# Altium project IO_Project.PrjPcb
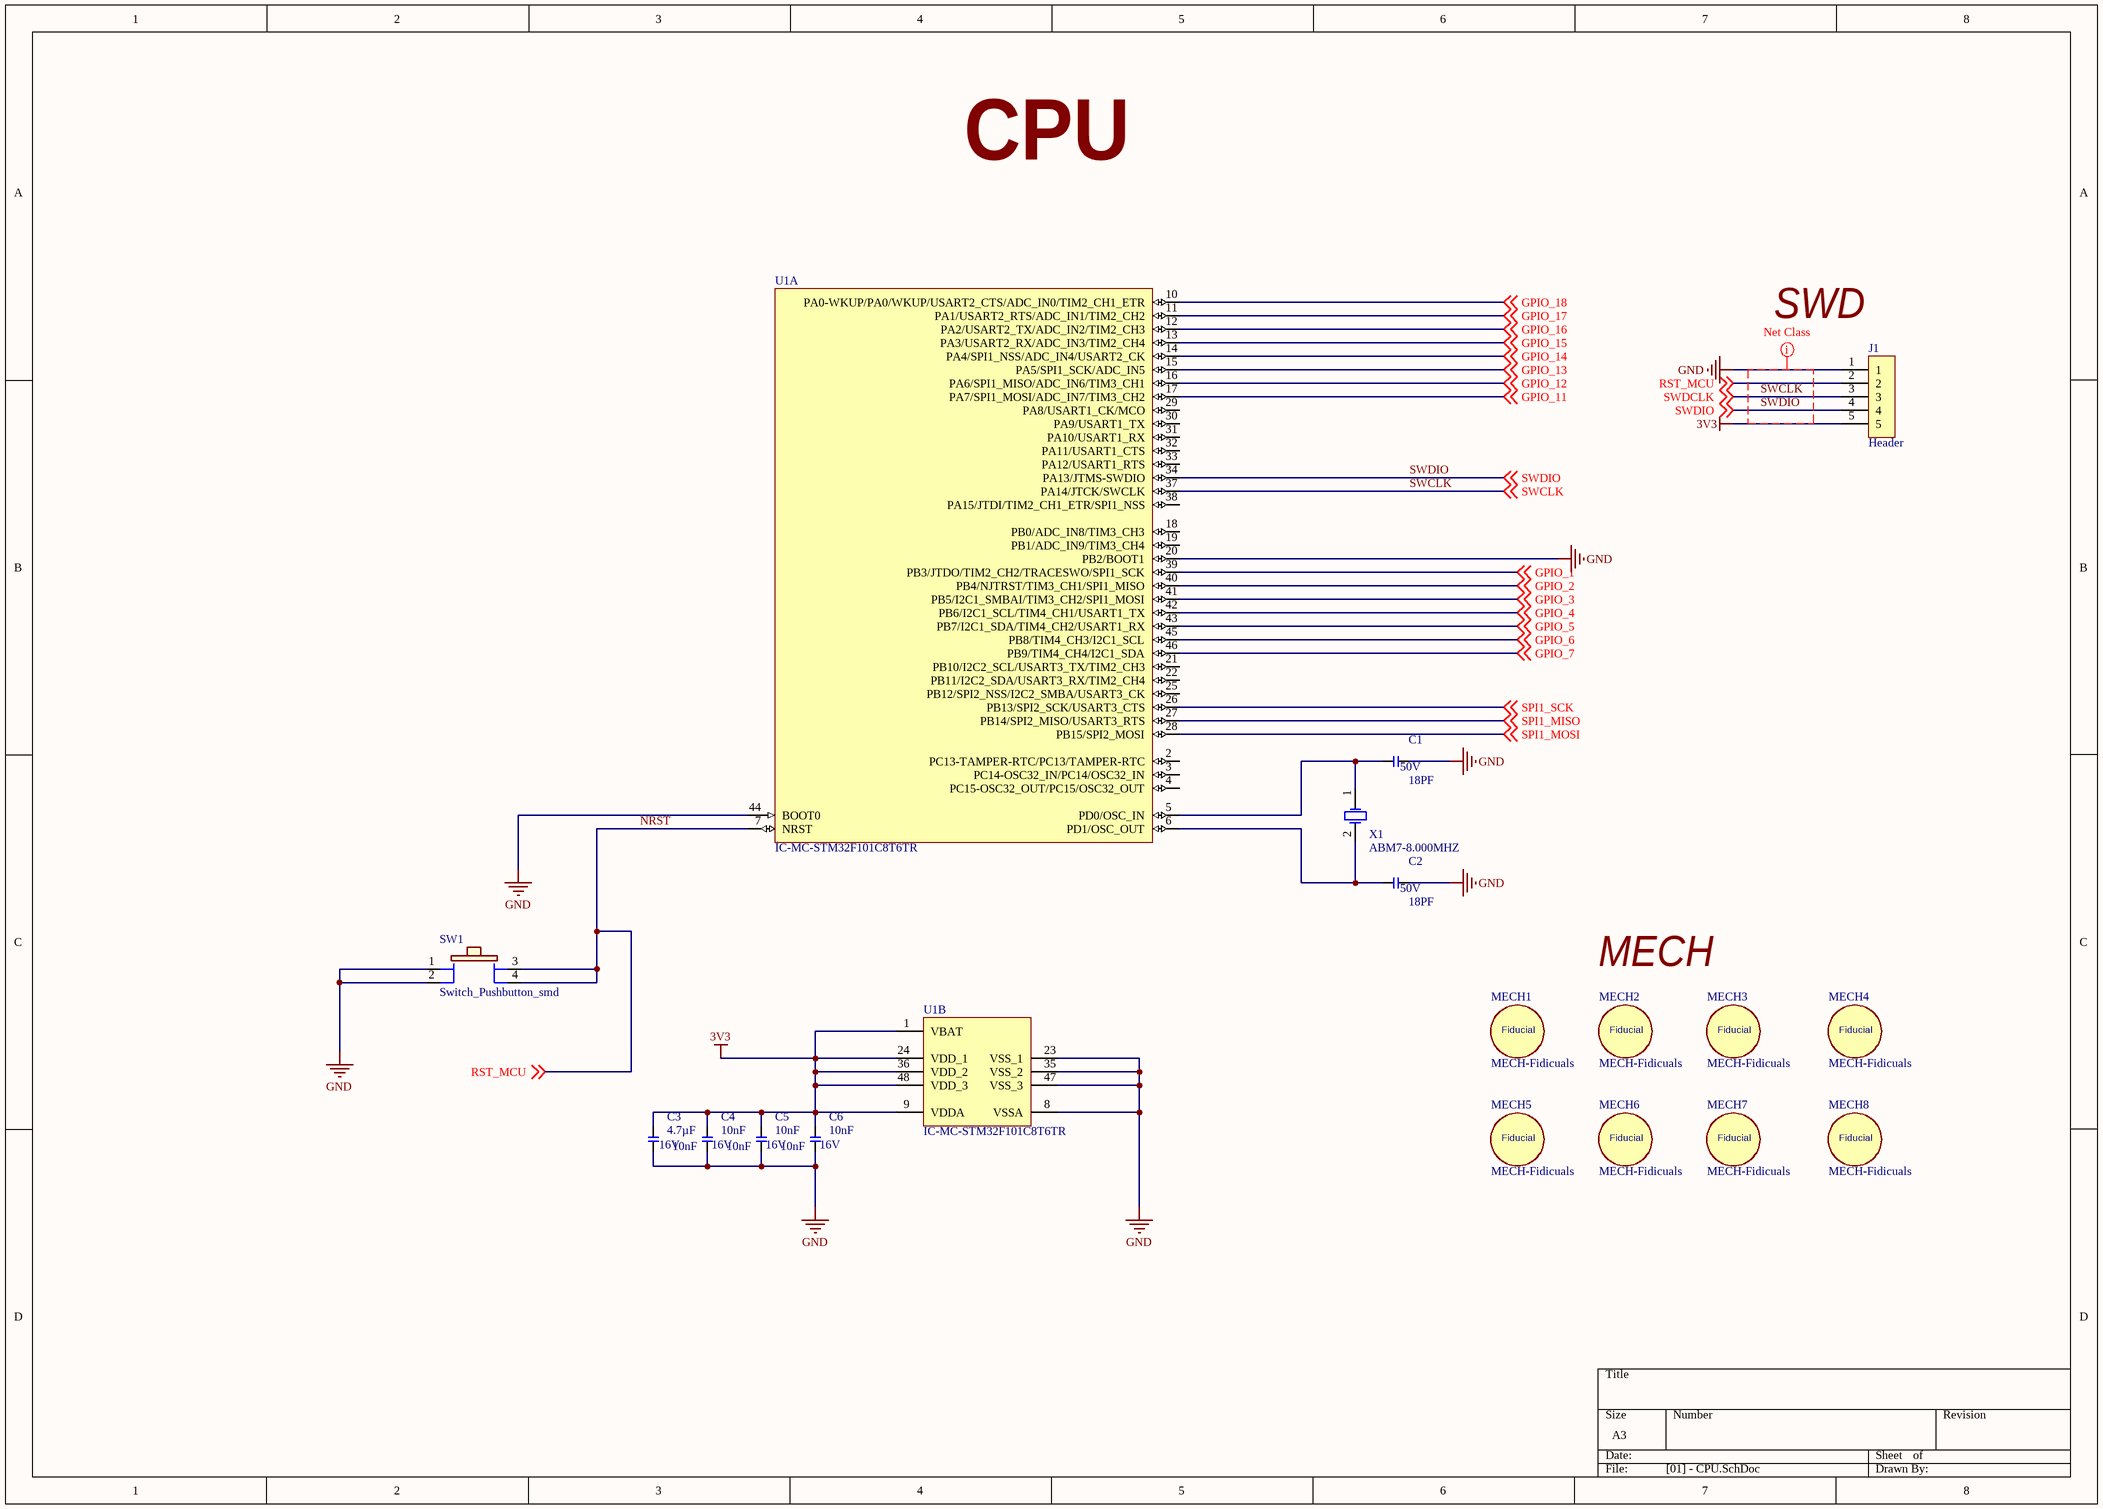
[diagram p0: [01] - CPU.SchDoc]
3 sheets, 47 parts. Net scope: global (net labels, ports and power ports of the same name join across sheets).
Board file: IO_PCB.PcbDoc
Sheets:
  [01] - CPU.SchDoc
  [02] - IO.SchDoc
  [03] - miniPCI.SchDoc

## Sheet [01] - CPU.SchDoc
size A3

### Parts
C1  18PF  voltage_rating_dc: 50V  [C0805]
C2  18PF  voltage_rating_dc: 50V  [C0805]
C3  4.7µF  Voltage - Rated: 16V  [C0805]
C4  10nF  Voltage - Rated: 16V  [C0805]
C5  10nF  Voltage - Rated: 16V  [C0805]
C6  10nF  Voltage - Rated: 16V  [C0805]
J1  Header  [Header 1x5 2.54mm]
MECH1  MECH-Fidicuals  [T-Fidicuals]
MECH2  MECH-Fidicuals  [T-Fidicuals]
MECH3  MECH-Fidicuals  [T-Fidicuals]
MECH4  MECH-Fidicuals  [T-Fidicuals]
MECH5  MECH-Fidicuals  [T-Fidicuals]
MECH6  MECH-Fidicuals  [T-Fidicuals]
MECH7  MECH-Fidicuals  [T-Fidicuals]
MECH8  MECH-Fidicuals  [T-Fidicuals]
SW1  Switch_Pushbutton_smd  [SW_B3SL-1022P]
U1  IC-MC-STM32F101C8T6TR  [STM-LQFP48_M]  (parts A,B of 2)
X1  ABM7-8.000MHZ  [sm_osc_mixed]

### Nets
3V3: C3.2 C4.2 C5.2 C6.2 J1.5 U1.1(VBAT) U1.9(VDDA) U1.24(VDD_1) U1.36(VDD_2) U1.48(VDD_3)
GND: C1.2 C2.2 C3.1 C4.1 C5.1 C6.1 J1.1 SW1.1 SW1.2 U1.8(VSSA) U1.20(PB2/BOOT1) U1.23(VSS_1) U1.35(VSS_2) U1.44(BOOT0) U1.47(VSS_3)
GPIO_1: U1.39(PB3/JTDO/TIM2_CH2/TRACESWO/SPI1_SCK) ; off-sheet GPIO_1  [project net gp_1]
GPIO_2: U1.40(PB4/NJTRST/TIM3_CH1/SPI1_MISO) ; off-sheet GPIO_2  [project net gp_2]
GPIO_3: U1.41(PB5/I2C1_SMBAI/TIM3_CH2/SPI1_MOSI) ; off-sheet GPIO_3  [project net gp_3]
GPIO_4: U1.42(PB6/I2C1_SCL/TIM4_CH1/USART1_TX) ; off-sheet GPIO_4  [project net gp_4]
GPIO_5: U1.43(PB7/I2C1_SDA/TIM4_CH2/USART1_RX) ; off-sheet GPIO_5  [project net gp_5]
GPIO_6: U1.45(PB8/TIM4_CH3/I2C1_SCL) ; off-sheet GPIO_6  [project net gp_6]
GPIO_7: U1.46(PB9/TIM4_CH4/I2C1_SDA) ; off-sheet GPIO_7  [project net gp_7]
GPIO_11: U1.17(PA7/SPI1_MOSI/ADC_IN7/TIM3_CH2) ; off-sheet GPIO_11  [project net gpo_1]
GPIO_12: U1.16(PA6/SPI1_MISO/ADC_IN6/TIM3_CH1) ; off-sheet GPIO_12  [project net gpo_2]
GPIO_13: U1.15(PA5/SPI1_SCK/ADC_IN5) ; off-sheet GPIO_13  [project net gpo_3]
GPIO_14: U1.14(PA4/SPI1_NSS/ADC_IN4/USART2_CK) ; off-sheet GPIO_14  [project net gpo_4]
GPIO_15: U1.13(PA3/USART2_RX/ADC_IN3/TIM2_CH4) ; off-sheet GPIO_15  [project net gpo_5]
GPIO_16: U1.12(PA2/USART2_TX/ADC_IN2/TIM2_CH3) ; off-sheet GPIO_16  [project net gpo_6]
GPIO_17: U1.11(PA1/USART2_RTS/ADC_IN1/TIM2_CH2) ; off-sheet GPIO_17  [project net gpo_7]
GPIO_18: U1.10(PA0-WKUP/PA0/WKUP/USART2_CTS/ADC_IN0/TIM2_CH1_ETR) ; off-sheet GPIO_18  [project net gpo_8]
NRST: J1.2 SW1.3 SW1.4 U1.7(NRST) ; off-sheet RST_MCU  [also labelled RST_MCU]
SPI1_MISO: U1.27(PB14/SPI2_MISO/USART3_RTS) ; off-sheet SPI1_MISO
SPI1_MOSI: U1.28(PB15/SPI2_MOSI) ; off-sheet SPI1_MOSI
SPI1_SCK: U1.26(PB13/SPI2_SCK/USART3_CTS) ; off-sheet SPI1_SCK
SWCLK: J1.3 U1.37(PA14/JTCK/SWCLK) ; off-sheet SWCLK, off-sheet SWDCLK  [also labelled SWDCLK]
SWDIO: J1.4 U1.34(PA13/JTMS-SWDIO) ; off-sheet SWDIO
NetC1_1: C1.1 U1.5(PD0/OSC_IN) X1.1(OSC1)
NetC2_1: C2.1 U1.6(PD1/OSC_OUT) X1.2(OSC2)

Not connected (* = marked no-connect by the designer): U1 2(PC13-TAMPER-RTC/PC13/TAMPER-RTC) 3(PC14-OSC32_IN/PC14/OSC32_IN) 4(PC15-OSC32_OUT/PC15/OSC32_OUT) 18(PB0/ADC_IN8/TIM3_CH3) 19(PB1/ADC_IN9/TIM3_CH4) 21(PB10/I2C2_SCL/USART3_TX/TIM2_CH3) 22(PB11/I2C2_SDA/USART3_RX/TIM2_CH4) 25(PB12/SPI2_NSS/I2C2_SMBA/USART3_CK) 29(PA8/USART1_CK/MCO) 30(PA9/USART1_TX) 31(PA10/USART1_RX) 32(PA11/USART1_CTS) 33(PA12/USART1_RTS) 38(PA15/JTDI/TIM2_CH1_ETR/SPI1_NSS)

### Layout directives
net class SWD: GND

### Notes on the sheet
- CPU
- (near J1) SWD
- MECH
- (in symbol MECH-Fidicuals) Fiducial

### Library data of the parts
C1 C2 = C-18PF,50V,0805: MULTICOMP - MC0805N180J500CT - CAP, MLCC, C0G/NP0, 18PF, 50V,0805, REEL; capacitance_tolerance: ±5%; pin_count: 2; Supplier 1: Octopart; Manufacturer: Multicomp; Manufacturer Part Number: MC0805N180J500CT; Pricing 1: 1=0.11400, 10=0.07300, 50=0.04100, 100=0.03200, 250=0.02600, 500=0.02200, 1000=0.01800 (USD); capacitance: 18PF; ComponentLink1URL: http://datasheet.octopart.com/MC0805N180J500CT-Multicomp-datasheet-16478625.pdf; ComponentLink1Description: http://datasheet.octopart.com/MC0805N180J500CT-Multicomp-datasheet-16478625.pdf; Supplier Part Number 1: Newark - 06R4039; Stock 1: 3187; reach_svhc_compliance: No SVHC; rohs_status: Compliant; dielectric_characteristic: C0G/NP0; Octopart Url: http://octopart.com/mc0805n180j500ct-multicomp-10529169; Seller Landing  Url: https://octopart-clicks.com/click/track?country=TR&ak=8157f166&sig=03c9fd1&sid=2402&ppid=10529169&vpid=17760821&ct=offers; OctopartID: 811748bd0de05ed0; ComponentLink2URL: http://datasheet.octopart.com/MC0805N180J500CT-Multicomp-datasheet-22150886.pdf; ComponentLink2Description: http://datasheet.octopart.com/MC0805N180J500CT-Multicomp-datasheet-22150886.pdf; ComponentLink3URL: http://datasheet.octopart.com/MC0805N180J500CT-Multicomp-datasheet-8445804.pdf; ComponentLink3Description: http://datasheet.octopart.com/MC0805N180J500CT-Multicomp-datasheet-8445804.pdf; ComponentLink4URL: http://datasheet.octopart.com/MC0805N180J500CT-Multicomp-datasheet-34215986.pdf; ComponentLink4Description: http://datasheet.octopart.com/MC0805N180J500CT-Multicomp-datasheet-34215986.pdf; ComponentLink5URL: http://datasheet.octopart.com/MC0805N180J500CT-Multicomp-datasheet-26590290.pdf; ComponentLink5Description: http://datasheet.octopart.com/MC0805N180J500CT-Multicomp-datasheet-26590290.pdf; ComponentLink6URL: http://datasheet.octopart.com/MC0805N180J500CT-Multicomp-datasheet-15500401.pdf; ComponentLink6Description: http://datasheet.octopart.com/MC0805N180J500CT-Multicomp-datasheet-15500401.pdf; ComponentLink7URL: http://datasheet.octopart.com/MC0805N180J500CT-Multicomp-datasheet-10838970.pdf; ComponentLink7Description: http://datasheet.octopart.com/MC0805N180J500CT-Multicomp-datasheet-10838970.pdf
C3 = C-4.7UF,16V,0805: AVX - 0805YC475KAT2A - CAP, MLCC, X7R, 4.7UF, 16V, 0805; Manufacturer: AVX Corporation; Tolerance: ±10%; Supplier 1: Digi-Key; Manufacturer Part Number: 0805YC475KAT2A; RoHS: RoHS Compliant; Stock 1: 16611; Pricing 1: 1=0.78, 10=0.578, 25=0.4952, 50=0.462, 100=0.396, 250=0.363, 500=0.3135, 1000=0.264 (USD); Capacitance: 4.7µF; Packaging: Cut Tape (CT); ComponentLink1URL: http://datasheets.avx.com/X7RDielectric.pdf; ComponentLink1Description: http://datasheets.avx.com/X7RDielectric.pdf; Supplier Part Number 1: 478-5722-1-ND; Category: Capacitors; Temperature Coefficient: X7R; Mounting Type: Surface Mount, MLCC; Operating Temperature: -55°C ~ 125°C; Applications: General Purpose; Ratings: -; Package / Case: 0805 (2012 Metric); Size / Dimension: 0.079" L x 0.049" W (2.01mm x 1.25mm); Height - Seated (Max): -; Thickness (Max): 0.060" (1.52mm); Lead Spacing: -; Features: -; Lead Style: -
C4-C6 = C-10NF,16V,0805: CAP CER 10000PF 16V NP0 0805; Manufacturer: AVX Corporation; Manufacturer Part Number: 0805YA103JAT2A; Tolerance: ±5%; Temperature Coefficient: C0G, NP0; Supplier 1: Digi-Key; RoHS: RoHS Compliant; Stock 1: 28062; Pricing 1: 1=0.29, 10=0.204, 25=0.1668, 50=0.1424, 100=0.1221, 250=0.10176, 500=0.09158, 1000=0.07733 (USD); ComponentLink1URL: http://datasheets.avx.com/C0GNP0-Dielectric.pdf; ComponentLink1Description: http://datasheets.avx.com/C0GNP0-Dielectric.pdf; Supplier Part Number 1: 478-1334-1-ND; Category: Capacitors; Packaging: Cut Tape (CT); Mounting Type: Surface Mount, MLCC; Operating Temperature: -55°C ~ 125°C; Applications: General Purpose; Ratings: -; Package / Case: 0805 (2012 Metric); Size / Dimension: 0.079" L x 0.049" W (2.01mm x 1.25mm); Height - Seated (Max): -; Thickness (Max): 0.037" (0.94mm); Lead Spacing: -; Features: -; Lead Style: -; Capacitance: 10nF
J1 = CON-Header 1X5 2.54MM: Header 1X5 2.54
MECH1-MECH8 = MECH-Fidicuals: Fidicuals
SW1 = Switch_Pushbutton_smd: Switch Push Button tactile; TIIntPartnumber: 2W0018; MfrNum: B3SL-1022P; Mfr: Omron; PartName: SwitchPushMomTactilesmd; Cost10K: 0.25; Cost100: 0.340; Vendor: Digikey; DescriptiveText: Switch Push Button tactile; Descriptive_Text: Switch Push Button tactile
U1 = IC-MC-STM32F101C8T6TR: IC MCU 32BIT 64KB FLASH 48LQFP; Manufacturer: STMicroelectronics; Program Memory Size: 64KB (64K x 8); Core Processor: ARM® Cortex®-M3; Core Size: 32-Bit; Speed: 36MHz; Connectivity: I²C, IrDA, LIN, SPI, UART/USART; Peripherals: DMA, PDR, POR, PVD, PWM, Temp Sensor, WDT; Number of I/O: 37; RAM Size: 10K x 8; Voltage - Supply (Vcc/Vdd): 2 V ~ 3.6 V; Data Converters: A/D 10x12b; Oscillator Type: Internal; Supplier 1: Digi-Key; Manufacturer Part Number: STM32F101C8T6TR; RoHS: RoHS Compliant; Category: Integrated Circuits (ICs); Stock 1: 0; Pricing 1: 2400=2.46449 (USD); Packaging: Tape & Reel (TR); Program Memory Type: FLASH; ComponentLink1URL: http://www.st.com/content/ccc/resource/technical/document/datasheet/6b/28/4e/ce/a7/d3/42/8d/CD00161561.pdf/files/CD00161561.pdf/jcr:content/translations/en.CD00161561.pdf; ComponentLink1Description: http://www.st.com/content/ccc/resource/technical/document/datasheet/6b/28/4e/ce/a7/d3/42/8d/CD00161561.pdf/files/CD00161561.pdf/jcr:content/translations/en.CD00161561.pdf; Supplier Part Number 1: STM32F101C8T6TR-ND; EEPROM Size: -; Operating Temperature: -40°C ~ 85°C (TA); Package / Case: 48-LQFP; Supplier Device Package: 48-LQFP (7x7)
X1 = OSC-ABM7-8.000MHZ-D2Y-T: CRYSTAL 8.0000MHZ 18PF SMD; Manufacturer: Abracon LLC; Frequency: 8MHz; Frequency Stability: ±30ppm; Frequency Tolerance: ±20ppm; ESR (Equivalent Series Resistance): 100 Ohm; Operating Mode: Fundamental; Supplier 1: Digi-Key; Manufacturer Part Number: ABM7-8.000MHZ-D2Y-T; RoHS: RoHS Compliant; Category: Crystals and Oscillators; Stock 1: 111842; Pricing 1: 1=0.76, 10=0.678, 50=0.6328, 100=0.56, 500=0.5292 (USD); Packaging: Cut Tape (CT); Type: MHz Crystal; Load Capacitance: 18pF; Operating Temperature: -40°C ~ 85°C; Ratings: -; Mounting Type: Surface Mount; Package / Case: 2-SMD, No Lead (DFN, LCC); Size / Dimension: 0.236" L x 0.138" W (6.00mm x 3.50mm); Height: 0.055" (1.40mm); ComponentLink1URL: http://www.abracon.com/Resonators/abm7.pdf; ComponentLink1Description: http://www.abracon.com/Resonators/abm7.pdf; Supplier Part Number 1: 535-9831-1-ND

## Sheet [02] - IO.SchDoc
size A2
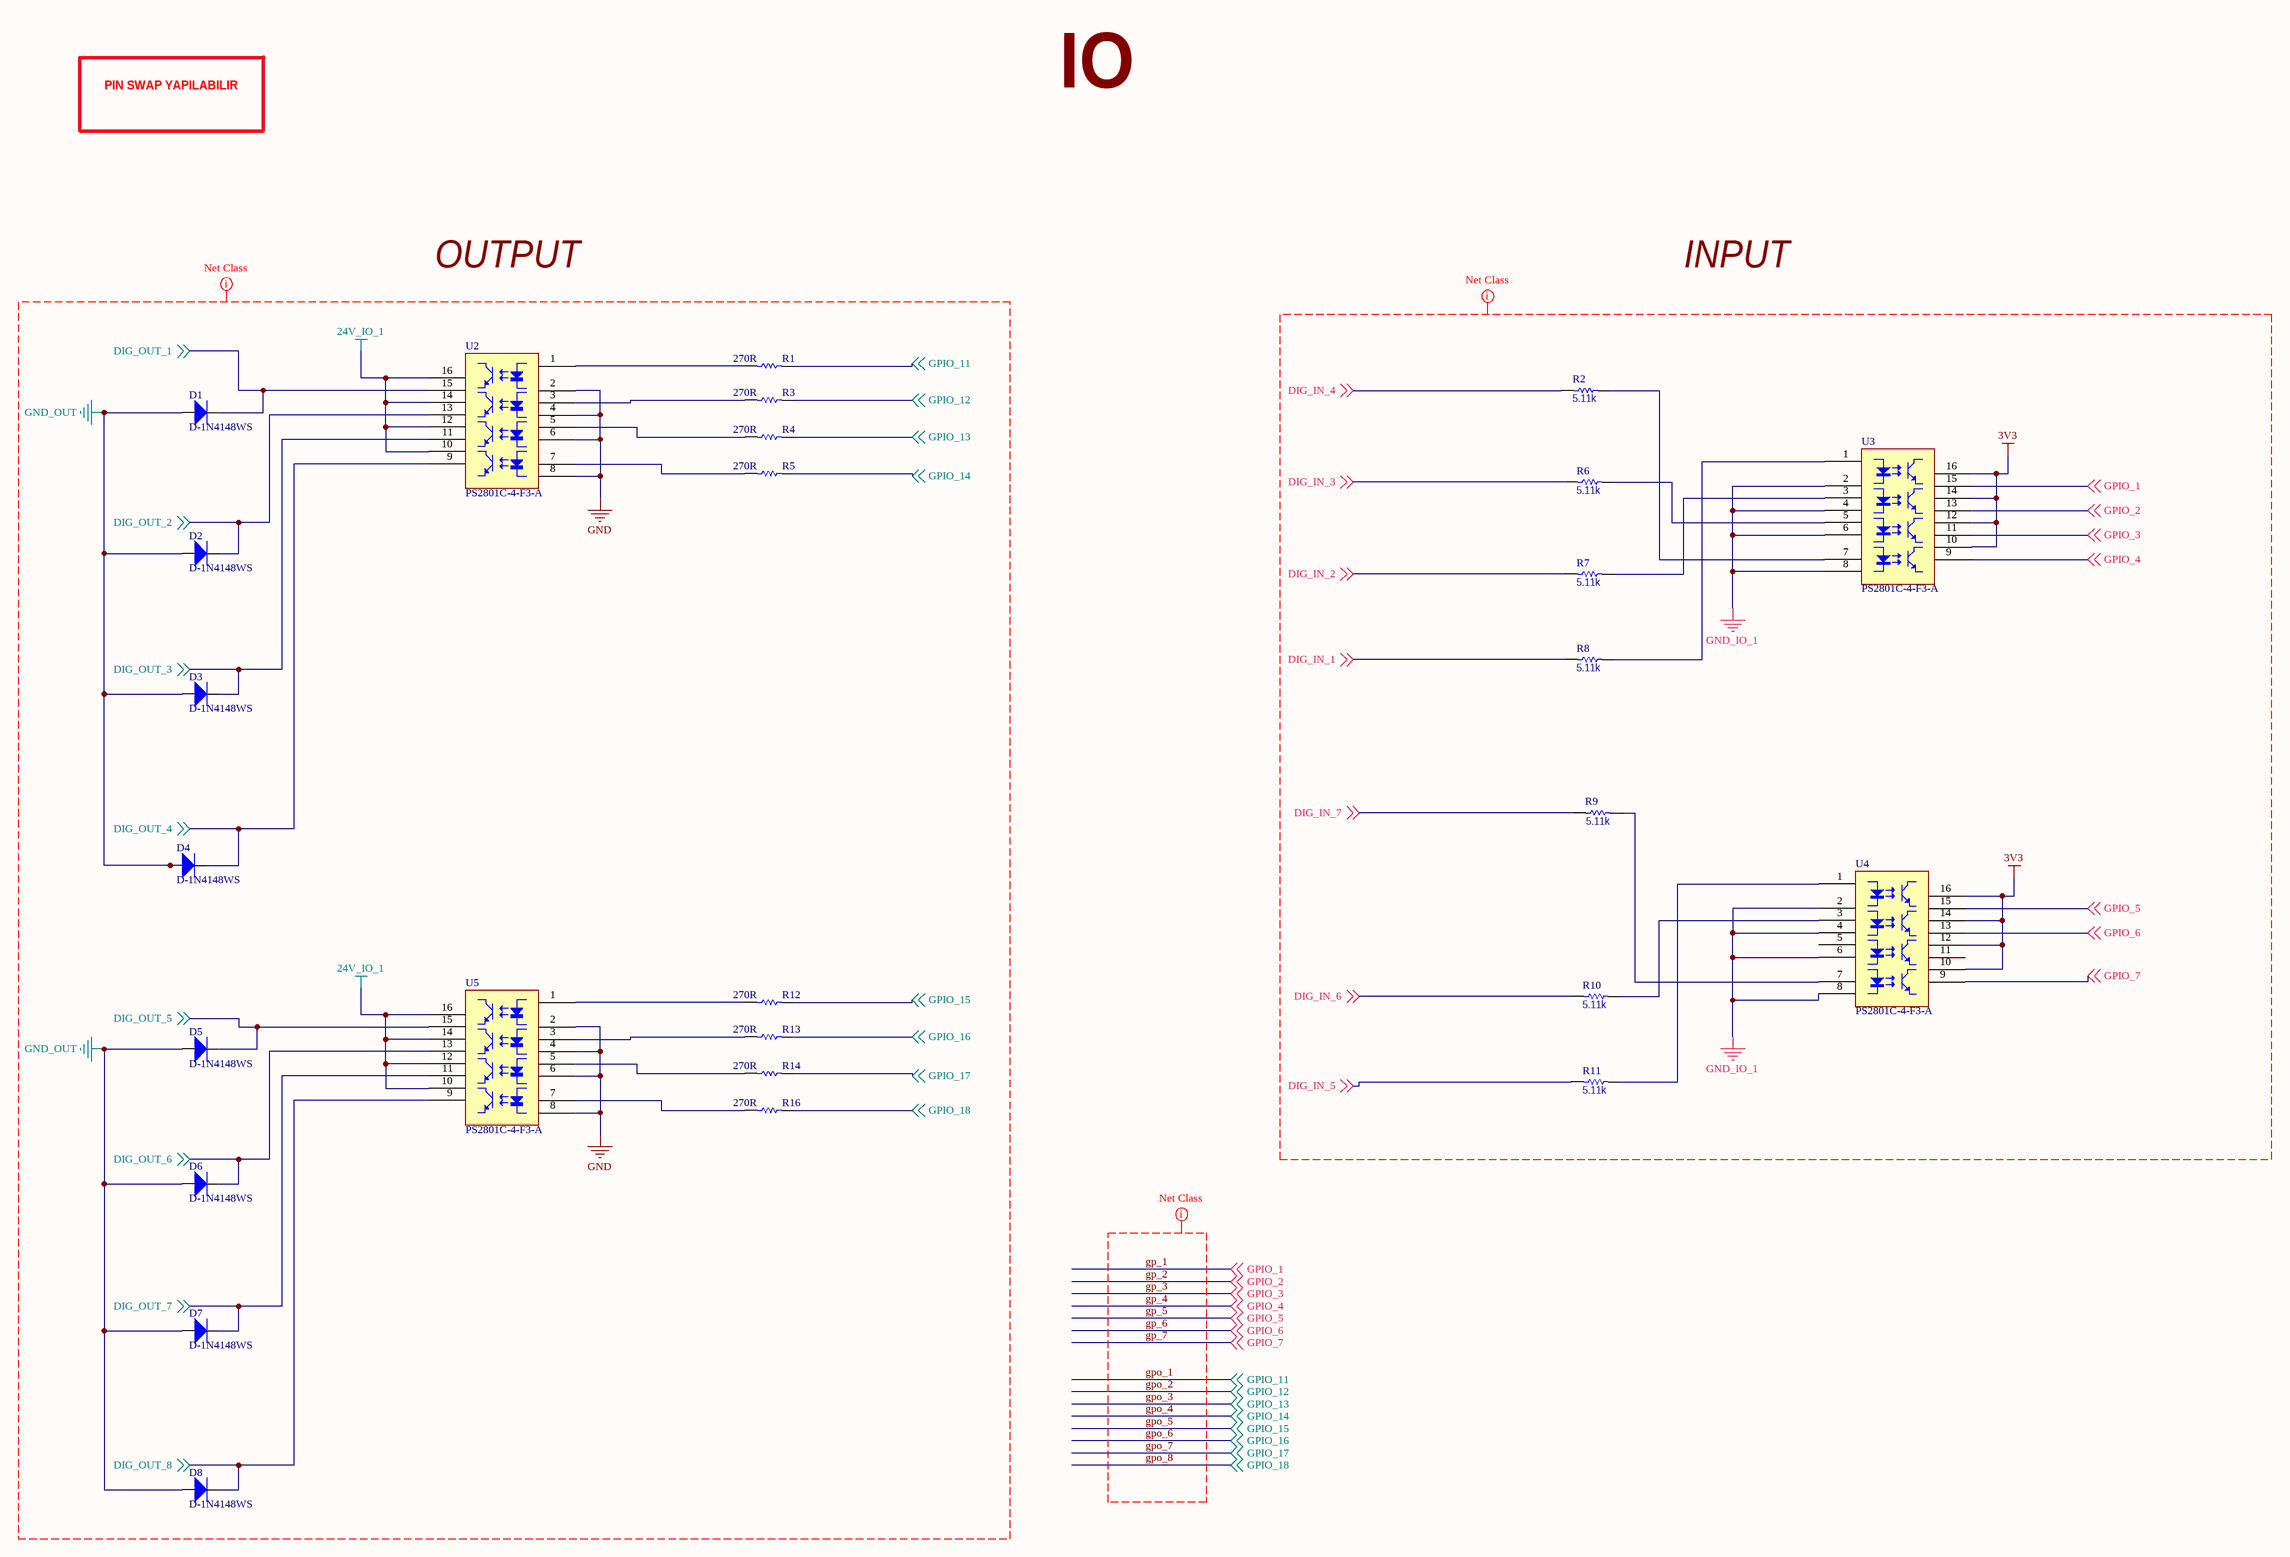
[diagram p1: [02] - IO.SchDoc]

### Parts
D1  D-1N4148WS  [SOD-323]
D2  D-1N4148WS  [SOD-323]
D3  D-1N4148WS  [SOD-323]
D4  D-1N4148WS  [SOD-323]
D5  D-1N4148WS  [SOD-323]
D6  D-1N4148WS  [SOD-323]
D7  D-1N4148WS  [SOD-323]
D8  D-1N4148WS  [SOD-323]
R1  270R  [R0805]
R2  Resistance (Ohms): 5.11k  [R1206]  (hidden comment: RES SMD 5.1K)
R3  270R  [R0805]
R4  270R  [R0805]
R5  270R  [R0805]
R6  Resistance (Ohms): 5.11k  [R1206]  (hidden comment: RES SMD 5.1K)
R7  Resistance (Ohms): 5.11k  [R1206]  (hidden comment: RES SMD 5.1K)
R8  Resistance (Ohms): 5.11k  [R1206]  (hidden comment: RES SMD 5.1K)
R9  Resistance (Ohms): 5.11k  [R1206]  (hidden comment: RES SMD 5.1K)
R10  Resistance (Ohms): 5.11k  [R1206]  (hidden comment: RES SMD 5.1K)
R11  Resistance (Ohms): 5.11k  [R1206]  (hidden comment: RES SMD 5.1K)
R12  270R  [R0805]
R13  270R  [R0805]
R14  270R  [R0805]
R16  270R  [R0805]
U2  PS2801C-4-F3-A  [U_16_D LONG]
U3  PS2801C-4-F3-A  [U_16_D LONG]
U4  PS2801C-4-F3-A  [U_16_D LONG]
U5  PS2801C-4-F3-A  [U_16_D LONG]

### Nets
3V3: U3.10 U3.12 U3.14 U3.16 U4.10 U4.12 U4.14 U4.16
24V_IO_1: U2.10 U2.12 U2.14 U2.16 U5.10 U5.12 U5.14 U5.16
GND: U2.2 U2.4 U2.6 U2.8 U5.2 U5.4 U5.6 U5.8
GND_IO_1: U3.2 U3.4 U3.6 U3.8 U4.2 U4.4 U4.6 U4.8
GND_OUT: D1.2 D2.2 D3.2 D4.2 D5.2 D6.2 D7.2 D8.2
DIG_IN_1: R8.1 ; off-sheet DIG_IN_1
DIG_IN_2: R7.1 ; off-sheet DIG_IN_2
DIG_IN_3: R6.1 ; off-sheet DIG_IN_3
DIG_IN_4: R2.1 ; off-sheet DIG_IN_4
DIG_IN_5: R11.1 ; off-sheet DIG_IN_5
DIG_IN_6: R10.1 ; off-sheet DIG_IN_6
DIG_IN_7: R9.1 ; off-sheet DIG_IN_7
DIG_OUT_1: D1.1 U2.15 ; off-sheet DIG_OUT_1
DIG_OUT_2: D2.1 U2.13 ; off-sheet DIG_OUT_2
DIG_OUT_3: D3.1 U2.11 ; off-sheet DIG_OUT_3
DIG_OUT_4: D4.1 U2.9 ; off-sheet DIG_OUT_4
DIG_OUT_5: D5.1 U5.15 ; off-sheet DIG_OUT_5
DIG_OUT_6: D6.1 U5.13 ; off-sheet DIG_OUT_6
DIG_OUT_7: D7.1 U5.11 ; off-sheet DIG_OUT_7
DIG_OUT_8: D8.1 U5.9 ; off-sheet DIG_OUT_8
gp_1: U3.15 ; off-sheet GPIO_1  [also labelled GPIO_1]
gp_2: U3.13 ; off-sheet GPIO_2  [also labelled GPIO_2]
gp_3: U3.11 ; off-sheet GPIO_3  [also labelled GPIO_3]
gp_4: U3.9 ; off-sheet GPIO_4  [also labelled GPIO_4]
gp_5: U4.15 ; off-sheet GPIO_5  [also labelled GPIO_5]
gp_6: U4.13 ; off-sheet GPIO_6  [also labelled GPIO_6]
gp_7: U4.9 ; off-sheet GPIO_7  [also labelled GPIO_7]
gpo_1: R1.2 ; off-sheet GPIO_11  [also labelled GPIO_11]
gpo_2: R3.2 ; off-sheet GPIO_12  [also labelled GPIO_12]
gpo_3: R4.2 ; off-sheet GPIO_13  [also labelled GPIO_13]
gpo_4: R5.2 ; off-sheet GPIO_14  [also labelled GPIO_14]
gpo_5: R12.2 ; off-sheet GPIO_15  [also labelled GPIO_15]
gpo_6: R13.2 ; off-sheet GPIO_16  [also labelled GPIO_16]
gpo_7: R14.2 ; off-sheet GPIO_17  [also labelled GPIO_17]
gpo_8: R16.2 ; off-sheet GPIO_18  [also labelled GPIO_18]
NetR1_1: R1.1 U2.1
NetR2_2: R2.2 U3.7
NetR3_1: R3.1 U2.3
NetR4_1: R4.1 U2.5
NetR5_1: R5.1 U2.7
NetR6_2: R6.2 U3.5
NetR7_2: R7.2 U3.3
NetR8_2: R8.2 U3.1
NetR9_2: R9.2 U4.7
NetR10_2: R10.2 U4.3
NetR11_2: R11.2 U4.1
NetR12_1: R12.1 U5.1
NetR13_1: R13.1 U5.3
NetR14_1: R14.1 U5.5
NetR16_1: R16.1 U5.7

Not connected (* = marked no-connect by the designer): U4 5 11

### Layout directives
net class stm_gpio: gp_1, gp_2, gp_3, gp_4, gp_5, gp_6, gp_7, gpo_1, gpo_2, gpo_3, gpo_4, gpo_5, gpo_6, gpo_7, gpo_8
net class Undefined: 3V3, 24V_IO_1, DIG_IN_1, DIG_IN_2, DIG_IN_3, DIG_IN_4, DIG_IN_5, DIG_IN_6, DIG_IN_7, DIG_OUT_1, DIG_OUT_2, DIG_OUT_3, DIG_OUT_4, DIG_OUT_5, DIG_OUT_6, DIG_OUT_7, DIG_OUT_8, GND, GND_IO_1, GND_OUT, GPIO_1, GPIO_2, GPIO_3, GPIO_4, GPIO_5, GPIO_6, GPIO_7, GPIO_11, GPIO_12, GPIO_13, GPIO_14, GPIO_15, GPIO_16, GPIO_17, GPIO_18

### Notes on the sheet
- PIN SWAP YAPILABILIR
- IO
- OUTPUT
- INPUT

### Library data of the parts
D1-D8 = D-1N4148WS: DIODES INC. - 1N4148WS-7-F - DIODE, SS SWITCH, 75V, 0.2W, SOD323; Diode Configuration: Single; Repetitive Reverse Voltage Vrrm Max: 75; Forward Current If(AV): 150; Forward Voltage VF Max: 1.25; Reverse Recovery Time trr Max: 4; Forward Surge Current Ifsm Max: 2; Product Range: 1N4148 Series; SVHC: No SVHC (17-Dec-2015); Diode Type: Switching; Supplier 1: Farnell; Manufacturer: DIODES INC.; Manufacturer Part Number: 1N4148WS-7-F; RoHS: YES; Stock 1: 52116; Pricing 1: 1=0.186, 25=0.142, 100=0.0928, 250=0.0514, 500=0.0433, 1000=0.0256, 3000=0.025, 8000=0.0239 (GBP); Operating Temperature Max: 150; Diode Case Style: SOD-323; No. of Pins: 2; Packaging: Cut Tape; MSL: MSL 1 - Unlimited; Operating Temperature Min: -65; Operating Temperature Range: -65°C to +150°C<!--FANDB--><div class="features-and-benefits-container"><div class="features-and-benefits-description"><span class="features-benefits-value">The 1N4148WS-7-F is a surface mount fast Switching Diode with matte tin-plated terminals and an UL94V-0 green molding compound molded plastic case. Solderable terminals as per MIL-STD-202, method 208 standard. Color band denotes cathode end polarity. It is suitable for general purpose switching applications.</span></div><div class="features-and-benefits-list"><ul class="features-and-benefits-list-list"><li class="features-and-benefits-list-item">Fast switching speed</li><li class="features-and-benefits-list-item">100V Non-repetitive peak reverse voltage</li><li class="features-and-benefits-list-item">53V RMS reverse voltage</li><li class="features-and-benefits-list-item">200mW Power dissipation</li><li class="features-and-benefits-list-item">625; ComponentLink1URL: http://www.farnell.com/datasheets/1911818.pdf; ComponentLink1Description: http://www.farnell.com/datasheets/1911818.pdf; Supplier Part Number 1: 1843678
R1 R3-R5 R12-R14 R16 = R-270R,0805: TE CONNECTIVITY / NEOHM 270R Thin Film; Manufacturer Part Number: CPF0805B270RE1; Product Range: TE CONNECTIVITY - CPF Series; Resistance: 270 Ohms; Power Rating: 100; Resistance Tolerance: ± 0.1%; Resistor Case Style: 0805 [2012 Metric]; Temperature Coefficient: ± 25; Voltage Rating: 200; External Depth: 0.5; External Length / Height: 2; External Width: 1.25; Resistor Mounting: SMD; Supplier 1: Farnell; Manufacturer: TE CONNECTIVITY / NEOHM; RoHS: YES; Stock 1: 755; Pricing 1: 10=0,43, 50=0,34, 100=0,32, 500=0,27, 1000=0,24 (EUR); Resistor Element Material: Thin Film; Packaging: Cut Tape; MSL: -; No. of Pins: 2; Operating Temperature Max: 155; Operating Temperature Min: -55; Operating Temperature Range: -55°C to +155; Series: CPF<!--FANDB--><div class="features-and-benefits-container"></div>; ComponentLink1URL: http://www.tycoelectronics.com/commerce/DocumentDelivery/DDEController?Action=srchrtrv&DocNm=1614884&DocType=Customer+Drawing&DocLang=English; ComponentLink1Description: http://www.tycoelectronics.com/commerce/DocumentDelivery/DDEController?Action=srchrtrv&DocNm=1614884&DocType=Customer+Drawing&DocLang=English; ComponentLink2URL: http://www.tycoelectronics.com/commerce/DocumentDelivery/DDEController?Action=srchrtrv&DocNm=1773200&DocType=Data+Sheet&DocLang=English; ComponentLink2Description: http://www.tycoelectronics.com/commerce/DocumentDelivery/DDEController?Action=srchrtrv&DocNm=1773200&DocType=Data+Sheet&DocLang=English; Supplier Part Number 1: 1697424
R2 R6-R11 = R-5.1K,1206: RES SMD 5.11K OHM 1% 1/2W 1206; Manufacturer: Stackpole Electronics Inc.; Manufacturer Part Number: RNCP1206FTD5K11; Power (Watts): 0.5W, 1/2W; Temperature Coefficient: ±100ppm/°C; Supplier 1: Digi-Key; RoHS: RoHS Compliant; Category: Resistors; Stock 1: 52805; Pricing 1: 1=0.1, 10=0.049, 50=0.0272, 100=0.0201, 250=0.01536, 500=0.01228, 1000=0.00904, 2500=0.00784 (USD); Packaging: Cut Tape (CT); Part Status: Active; Tolerance: ±1%; Composition: Thin Film; Features: Anti-Sulfur, Moisture Resistant; Operating Temperature: -55°C ~ 155°C; Package / Case: 1206 (3216 Metric); Supplier Device Package: 1206; Size / Dimension: 0.122" L x 0.059" W (3.10mm x 1.50mm); Height: 0.024" (0.60mm); Number of Terminations: 2; Failure Rate: -; ComponentLink1URL: http://www.seielect.com/catalog/SEI-RNCP.pdf; ComponentLink1Description: http://www.seielect.com/catalog/SEI-RNCP.pdf; Supplier Part Number 1: RNCP1206FTD5K11CT-ND
U2-U5 = PS2801C-4-F3-A: NEC - PS2801C-4-F3-A - OPTOCOUPLER, 4X TR O/P, SSOP-16; Supplier 1: Farnell; Supplier Part Number 1: 1682862

## Sheet [03] - miniPCI.SchDoc
size A0
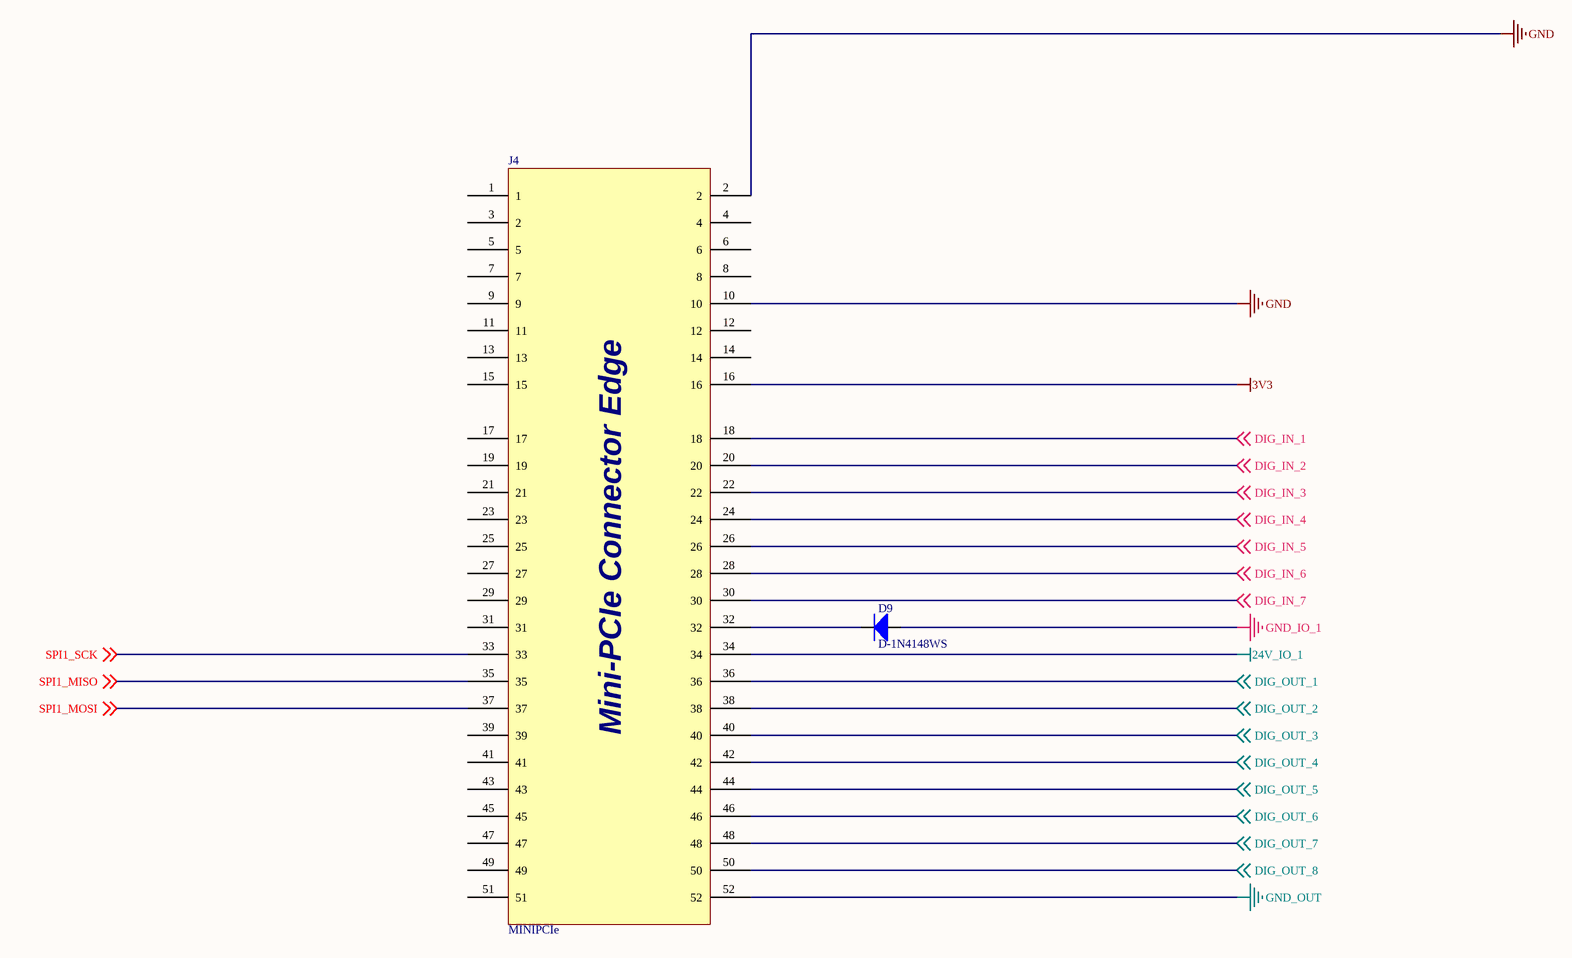
[diagram p2: [03] - miniPCI.SchDoc]

### Parts
D9  D-1N4148WS  [SOD-323]
J4  MINIPCIe  [MINI PCIe]

### Nets
3V3: J4.16
24V_IO_1: J4.34
GND: J4.2 J4.10
GND_IO_1: D9.2
GND_OUT: J4.52
DIG_IN_1: J4.18 ; off-sheet DIG_IN_1
DIG_IN_2: J4.20 ; off-sheet DIG_IN_2
DIG_IN_3: J4.22 ; off-sheet DIG_IN_3
DIG_IN_4: J4.24 ; off-sheet DIG_IN_4
DIG_IN_5: J4.26 ; off-sheet DIG_IN_5
DIG_IN_6: J4.28 ; off-sheet DIG_IN_6
DIG_IN_7: J4.30 ; off-sheet DIG_IN_7
DIG_OUT_1: J4.36 ; off-sheet DIG_OUT_1
DIG_OUT_2: J4.38 ; off-sheet DIG_OUT_2
DIG_OUT_3: J4.40 ; off-sheet DIG_OUT_3
DIG_OUT_4: J4.42 ; off-sheet DIG_OUT_4
DIG_OUT_5: J4.44 ; off-sheet DIG_OUT_5
DIG_OUT_6: J4.46 ; off-sheet DIG_OUT_6
DIG_OUT_7: J4.48 ; off-sheet DIG_OUT_7
DIG_OUT_8: J4.50 ; off-sheet DIG_OUT_8
SPI1_MISO: J4.35 ; off-sheet SPI1_MISO
SPI1_MOSI: J4.37 ; off-sheet SPI1_MOSI
SPI1_SCK: J4.33 ; off-sheet SPI1_SCK
NetD9_1: D9.1 J4.32

Not connected (* = marked no-connect by the designer): J4 1 3(2) 4 5 6 7 8 9 11 12 13 14 15 17 19 21 23 25 27 29 31 39 41 43 45 47 49 51

### Notes on the sheet
- (in symbol MINIPCIe) Mini-PCIe Connector Edge

### Library data of the parts
D9 = D-1N4148WS: as D1 on sheet [02] - IO; Supplier 1: Farnell; Manufacturer: DIODES INC.; Manufacturer Part Number: 1N4148WS-7-F; RoHS: YES; Stock 1: 52116; Pricing 1: 1=0.186, 25=0.142, 100=0.0928, 250=0.0514, 500=0.0433, 1000=0.0256, 3000=0.025, 8000=0.0239 (GBP); Operating Temperature Max: 150; Diode Case Style: SOD-323; No. of Pins: 2; Packaging: Cut Tape; MSL: MSL 1 - Unlimited; Operating Temperature Min: -65; Operating Temperature Range: -65°C to +150°C<!--FANDB--><div class="features-and-benefits-container"><div class="features-and-benefits-description"><span class="features-benefits-value">The 1N4148WS-7-F is a surface mount fast Switching Diode with matte tin-plated terminals and an UL94V-0 green molding compound molded plastic case. Solderable terminals as per MIL-STD-202, method 208 standard. Color band denotes cathode end polarity. It is suitable for general purpose switching applications.</span></div><div class="features-and-benefits-list"><ul class="features-and-benefits-list-list"><li class="features-and-benefits-list-item">Fast switching speed</li><li class="features-and-benefits-list-item">100V Non-repetitive peak reverse voltage</li><li class="features-and-benefits-list-item">53V RMS reverse voltage</li><li class="features-and-benefits-list-item">200mW Power dissipation</li><li class="features-and-benefits-list-item">625; ComponentLink1URL: http://www.farnell.com/datasheets/1911818.pdf; ComponentLink1Description: http://www.farnell.com/datasheets/1911818.pdf; Supplier Part Number 1: 1843678

## Nets that join several sheets
3V3: [01] - CPU (10 pins), [02] - IO (8 pins), [03] - miniPCI (J4.16)
24V_IO_1: [02] - IO (8 pins), [03] - miniPCI (J4.34)
GND: [01] - CPU (15 pins), [02] - IO (8 pins), [03] - miniPCI (J4.2 J4.10)
GND_IO_1: [02] - IO (8 pins), [03] - miniPCI (D9.2)
GND_OUT: [02] - IO (8 pins), [03] - miniPCI (J4.52)
DIG_IN_1: [02] - IO (R8.1), [03] - miniPCI (J4.18)
DIG_IN_2: [02] - IO (R7.1), [03] - miniPCI (J4.20)
DIG_IN_3: [02] - IO (R6.1), [03] - miniPCI (J4.22)
DIG_IN_4: [02] - IO (R2.1), [03] - miniPCI (J4.24)
DIG_IN_5: [02] - IO (R11.1), [03] - miniPCI (J4.26)
DIG_IN_6: [02] - IO (R10.1), [03] - miniPCI (J4.28)
DIG_IN_7: [02] - IO (R9.1), [03] - miniPCI (J4.30)
DIG_OUT_1: [02] - IO (D1.1 U2.15), [03] - miniPCI (J4.36)
DIG_OUT_2: [02] - IO (D2.1 U2.13), [03] - miniPCI (J4.38)
DIG_OUT_3: [02] - IO (D3.1 U2.11), [03] - miniPCI (J4.40)
DIG_OUT_4: [02] - IO (D4.1 U2.9), [03] - miniPCI (J4.42)
DIG_OUT_5: [02] - IO (D5.1 U5.15), [03] - miniPCI (J4.44)
DIG_OUT_6: [02] - IO (D6.1 U5.13), [03] - miniPCI (J4.46)
DIG_OUT_7: [02] - IO (D7.1 U5.11), [03] - miniPCI (J4.48)
DIG_OUT_8: [02] - IO (D8.1 U5.9), [03] - miniPCI (J4.50)
gp_1: [01] - CPU (U1.39), [02] - IO (U3.15)
gp_2: [01] - CPU (U1.40), [02] - IO (U3.13)
gp_3: [01] - CPU (U1.41), [02] - IO (U3.11)
gp_4: [01] - CPU (U1.42), [02] - IO (U3.9)
gp_5: [01] - CPU (U1.43), [02] - IO (U4.15)
gp_6: [01] - CPU (U1.45), [02] - IO (U4.13)
gp_7: [01] - CPU (U1.46), [02] - IO (U4.9)
gpo_1: [01] - CPU (U1.17), [02] - IO (R1.2)
gpo_2: [01] - CPU (U1.16), [02] - IO (R3.2)
gpo_3: [01] - CPU (U1.15), [02] - IO (R4.2)
gpo_4: [01] - CPU (U1.14), [02] - IO (R5.2)
gpo_5: [01] - CPU (U1.13), [02] - IO (R12.2)
gpo_6: [01] - CPU (U1.12), [02] - IO (R13.2)
gpo_7: [01] - CPU (U1.11), [02] - IO (R14.2)
gpo_8: [01] - CPU (U1.10), [02] - IO (R16.2)
SPI1_MISO: [01] - CPU (U1.27), [03] - miniPCI (J4.35)
SPI1_MOSI: [01] - CPU (U1.28), [03] - miniPCI (J4.37)
SPI1_SCK: [01] - CPU (U1.26), [03] - miniPCI (J4.33)